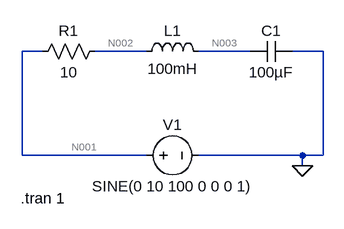
[diagram p0: schematic Draft1.asc]
Draft1.asc, the LTspice schematic file:
Version 4
SHEET 1 880 680
WIRE -112 48 -144 48
WIRE 48 48 -32 48
WIRE 208 48 128 48
WIRE 320 48 272 48
WIRE -144 208 -144 48
WIRE 48 208 -144 208
WIRE 288 208 128 208
WIRE 320 208 320 48
WIRE 320 208 288 208
WIRE 288 224 288 208
FLAG 288 224 0
SYMBOL res -128 64 R270
WINDOW 0 32 56 VTop 2
WINDOW 3 0 56 VBottom 2
SYMATTR InstName R1
SYMATTR Value 10
SYMBOL ind 32 64 R270
WINDOW 0 32 56 VTop 2
WINDOW 3 5 56 VBottom 2
SYMATTR InstName L1
SYMATTR Value 100mH
SYMBOL cap 208 64 R270
WINDOW 0 32 32 VTop 2
WINDOW 3 0 32 VBottom 2
SYMATTR InstName C1
SYMATTR Value 100µF
SYMBOL voltage 32 208 R270
WINDOW 0 32 56 VTop 2
WINDOW 3 -32 56 VBottom 2
WINDOW 123 0 0 Left 0
WINDOW 39 0 0 Left 0
SYMATTR InstName V1
SYMATTR Value SINE(0 10 100 0 0 0 1)
TEXT -146 274 Left 2 !.tran 1

The netlist it stands for:
* Draft1.asc
R1 N001 N002 10
L1 N002 N003 100mH
C1 N003 0 100µF
V1 N001 0 SINE(0 10 100 0 0 0 1)
.tran 1
.backanno
.end

* Results of the author's LTspice run, read from the files saved beside the schematic
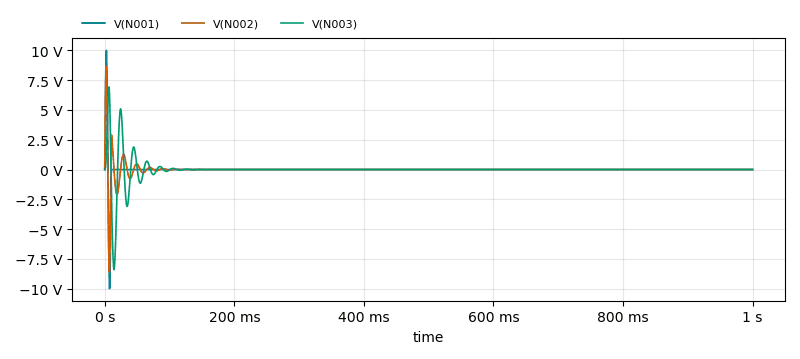
[diagram p1: Transient Analysis of Draft1.asc, plotted from the saved traces]
* Transient Analysis, 1 run:
*   V(N001): min -9.999 V, max 9.989 V, average -31.48 µV, rms 711.9 mV, last 0 V
*   V(N002): min -8.614 V, max 8.663 V, average -90.93 µV, rms 635.3 mV, last 0 V
*   V(N003): min -8.391 V, max 6.928 V, average 136.6 µV, rms 853.4 mV, last 0 V